# EAGLE schematic relay (EAGLE 6.5.0)
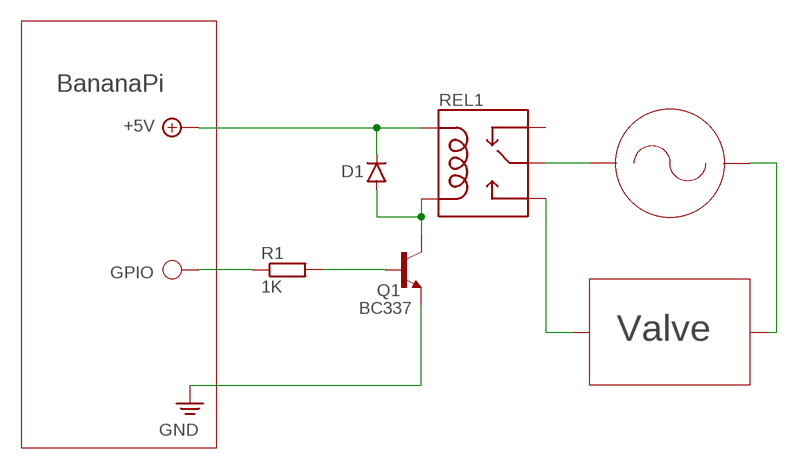
[diagram p0: schematic, sheet 1]

## Parts
D1  DIODE  [DIODE-1N4001-KIT]
Q1  BC337  [TO92]
R1  1K  R-EU_0207/15  [0207/15]
REL1  RELAYPTH  [RELAY-G5Q]

## Nets
+5V: D1.C REL1.5(COIL1)
N$1: Q1.2(B) R1.2
N$2: D1.A Q1.3(C) REL1.1(COIL2)
N$3: R1.1
N$4: REL1.2(MAIN)
N$5: REL1.3(NO)
PE: Q1.1(E) ; supply symbol labelled GND
Unconnected: REL1.4(NC)

## Notes on the sheet
- BananaPi
- GPIO
- Valve

## Library data of the parts
D1 = SparkFun-DiscreteSemi:DIODE: Diode These are standard reverse protection diodes and small signal diodes. SMA package can handle up to about 1A. SOD-323 can handle about 200mA. What the SOD-323 package when ordering, there are some mfgs out there that are 5-pin packages.
Q1 = transistor-neu-to92:BC337: NPN TRANSISTOR
R1 = resistor:R-EU_: RESISTOR, European symbol
REL1 = SparkFun-Electromechanical:RELAY: SPDT relay (COM-00101)